# EAGLE design fri3d_badge_2016 (EAGLE 7.5.0)
CNAME: Fri3d Camp Badge; CREVISION: 5; DESIGNER: Christophe VG
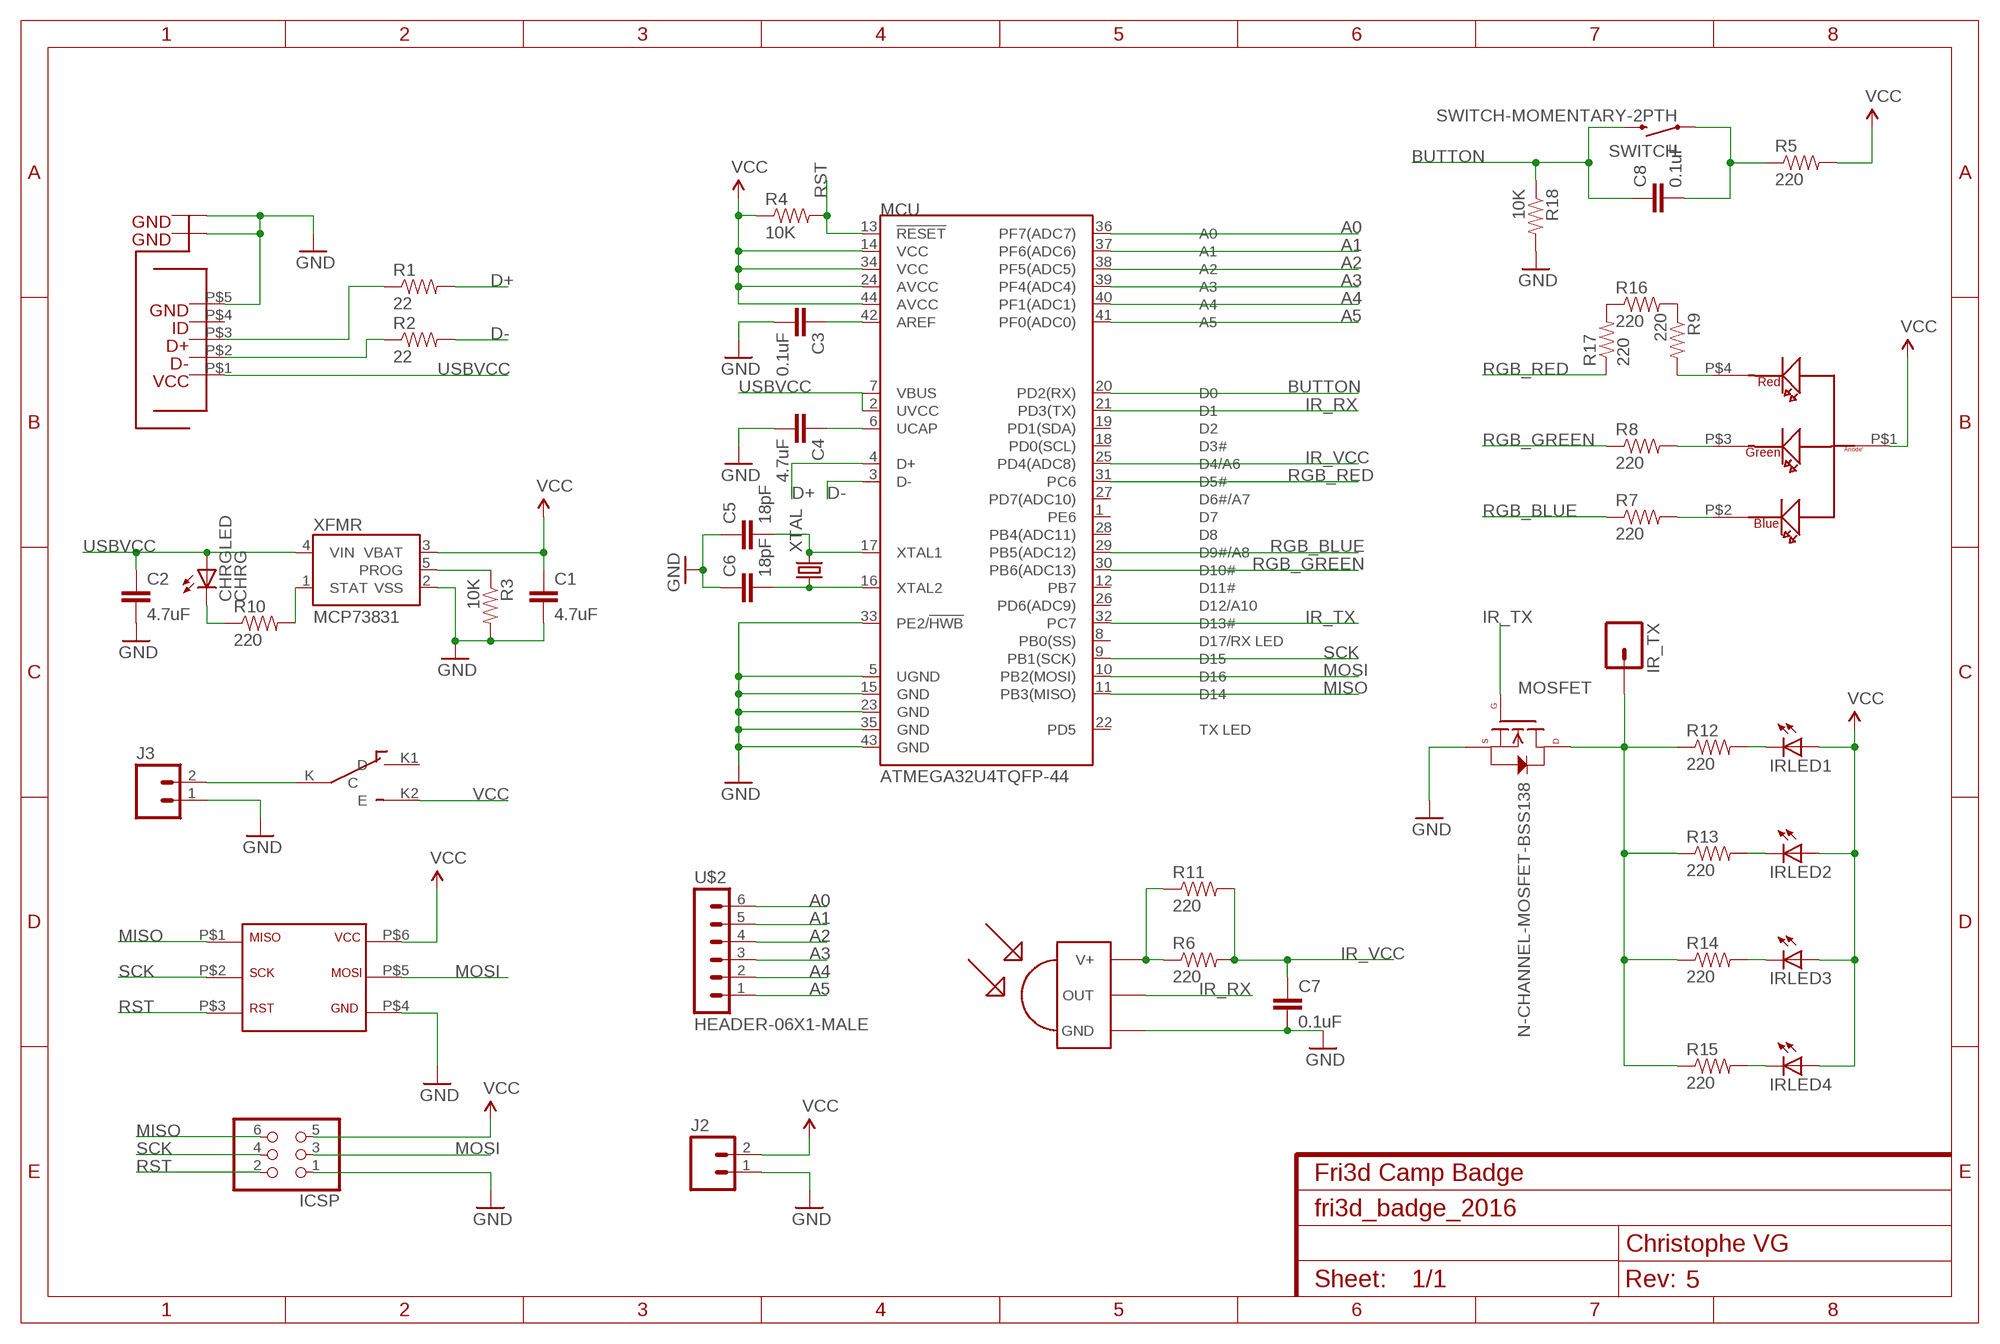
[diagram p0: schematic, sheet 1]

## Parts
C1  4.7uF  CAP0805  [0805]
C2  4.7uF  CAP0805  [0805]
C3  0.1uF  CAP0805  [0805]
C4  4.7uF  CAP0805  [0805]
C5  18pF  CAP0805  [0805]
C6  18pF  CAP0805  [0805]
C7  0.1uF  CAP0805  [0805]
C8  0.1uF  CAP0805  [0805]
CHRGLED  CHRG  LEDCHIPLED_0805  [CHIPLED_0805]
ICSP  PINHD-2X3  [2X03]
IR_TX  M01PTH  [1X01]
IRLED1  LEDCHIPLED_0805  [CHIPLED_0805]
IRLED2  LEDCHIPLED_0805  [CHIPLED_0805]
IRLED3  LEDCHIPLED_0805  [CHIPLED_0805]
IRLED4  LEDCHIPLED_0805  [CHIPLED_0805]
J2  M02PTH  [1X02]
J3  M02JST-PTH-2  [JST-2-PTH]
MCU  ATMEGA32U4TQFP-44  [TQFP44]
MOSFET  N-CHANNEL-MOSFET-BSS138  [SOT23-3]
R1  22  RESISTOR0805-RES  [0805]
R2  22  RESISTOR0805-RES  [0805]
R3  10K  RESISTOR0805-RES  [0805]
R4  10K  RESISTOR0805-RES  [0805]
R5  220  RESISTOR0805-RES  [0805]
R6  220  RESISTOR0805-RES  [0805]
R7  220  RESISTOR0805-RES  [0805]
R8  220  RESISTOR0805-RES  [0805]
R9  220  RESISTOR0805-RES  [0805]
R10  220  RESISTOR0805-RES  [0805]
R11  220  RESISTOR0805-RES  [0805]
R12  220  RESISTOR0805-RES  [0805]
R13  220  RESISTOR0805-RES  [0805]
R14  220  RESISTOR0805-RES  [0805]
R15  220  RESISTOR0805-RES  [0805]
R16  220  RESISTOR0805-RES  [0805]
R17  220  RESISTOR0805-RES  [0805]
R18  10K  RESISTOR0805-RES  [0805]
SWITCH  SWITCH-MOMENTARY-2PTH  [TACTILE-PTH]
U$2  HEADER-06X1-MALE  [06X1-PTH]
U$3  TSOP4838  [TSOP18XX]
U$4  DRAGAN-PERSONAL_AVAGO-RGB-LED  [DRAGAN-PERSONAL_AVAGO-RGB-LED]
U$5  OCTA-CORE_MCIRO-USB2MOUSER  [OCTA-CORE_MICRO-USB2]
U$6  SLIDE-SWITCH  [SLIDE-SWITCH]
U$7  OCTA-CORE_TC2030-IDC  [OCTA-CORE_TC2030-IDC]
XFMR  MCP73831  [SOT23-5]
XTAL  CRYSTALHC49S  [HC49/S]

## Nets
A0: MCU.36(PF7(ADC7)) U$2.6
A1: MCU.37(PF6(ADC6)) U$2.5
A2: MCU.38(PF5(ADC5)) U$2.4
A3: MCU.39(PF4(ADC4)) U$2.3
A4: MCU.40(PF1(ADC1)) U$2.2
A5: MCU.41(PF0(ADC0)) U$2.1
BUTTON: C8.1 MCU.20(PD2(RX)) R18.1 SWITCH.3
D+: MCU.4(D+) R1.2
D-: MCU.3(D-) R2.2
GND: C1.2 C2.2 C3.2 C4.2 C5.1 C6.1 C7.2 ICSP.1 J2.1 J3.1 MCU.5(UGND) MCU.15(GND) MCU.23(GND) MCU.33(PE2/!HWB) MCU.35(GND) MCU.43(GND) MOSFET.2(S) R3.2 R18.2 U$3.GND U$5.P$5 U$5.P$6 U$5.P$7 U$5.P$8 U$5.P$9 U$5.P$10 U$5.P$11 U$5.P$12 U$5.P$13 U$7.P$4 XFMR.2(VSS)
IR_RX: MCU.21(PD3(TX)) U$3.OUT
IR_TX: MCU.32(PC7) MOSFET.1(G)
IR_VCC: C7.1 MCU.25(PD4(ADC8)) R6.2 R11.2
MISO: ICSP.6 MCU.11(PB3(MISO)) U$7.P$1
MOSI: ICSP.3 MCU.10(PB2(MOSI)) U$7.P$5
N$1: R2.1 U$5.P$2
N$2: R1.1 U$5.P$3
N$3: C8.2 R5.1 SWITCH.1
N$4: C4.1 MCU.6(UCAP)
N$5: R3.1 XFMR.5(PROG)
N$6: CHRGLED.C R10.1
N$7: C3.1 MCU.42(AREF)
N$8: C5.2 MCU.17(XTAL1) XTAL.2
N$9: C6.2 MCU.16(XTAL2) XTAL.1
N$10: R6.1 R11.1 U$3.VCC(V+)
N$11: R9.1 R16.2
N$12: R16.1 R17.2
N$13: IRLED1.C R12.2
N$14: IRLED2.C R13.2
N$15: IRLED3.C R14.2
N$16: IRLED4.C R15.2
N$17: J3.2 U$6.K(C)
N$18: R9.2 U$4.P$4
N$19: R8.2 U$4.P$3
N$20: R7.2 U$4.P$2
N$22: R10.2 XFMR.1(STAT)
N$24: IR_TX.1 MOSFET.3(D) R12.1 R13.1 R14.1 R15.1
RGB_BLUE: MCU.29(PB5(ADC12)) R7.1
RGB_GREEN: MCU.30(PB6(ADC13)) R8.1
RGB_RED: MCU.31(PC6) R17.1
RST: ICSP.2 MCU.13(!RESET) R4.2 U$7.P$3
SCK: ICSP.4 MCU.9(PB1(SCK)) U$7.P$2
USBVCC: C2.1 CHRGLED.A MCU.2(UVCC) MCU.7(VBUS) U$5.P$1 XFMR.4(VIN)
VCC: C1.1 ICSP.5 IRLED1.A IRLED2.A IRLED3.A IRLED4.A J2.2 MCU.14(VCC) MCU.24(AVCC) MCU.34(VCC) MCU.44(AVCC) R4.1 R5.2 U$4.P$1 U$6.K2(E) U$7.P$6 XFMR.3(VBAT)
Unconnected: MCU.1(PE6) MCU.8(PB0(SS)) MCU.12(PB7) MCU.18(PD0(SCL)) MCU.19(PD1(SDA)) MCU.22(PD5) MCU.26(PD6(ADC9)) MCU.27(PD7(ADC10)) MCU.28(PB4(ADC11)) U$5.P$4 U$6.K1(D)

## Library data of the parts
C1-C8 = SparkFun-Capacitors:CAP: Capacitor Standard 0603 ceramic capacitor, and 0.1" leaded capacitor.
CHRGLED = adafruit:LED: LED
ICSP = SparkFun-Connectors:PINHD-2X3: PIN HEADER
IR_TX = SparkFun-Connectors:M01: Header 1 Standard 1-pin 0.1" header. Use with straight break away headers (SKU : PRT-00116), right angle break away headers (PRT-00553), swiss pins (PRT-00743), machine pins (PRT-00117), and female headers (PRT-00115). SMTSO-256-ET is a "flush mount" nut for a 4-40 screw. The older package used to be too tight, and did not allow it to sit properly thru the drill hit. The latest (0.165DIA) fits nice and snug.
IRLED1-IRLED4 = led:LED: LED
J2 = SparkFun-Connectors:M02: Standard 2-pin 0.1" header. Use with - straight break away headers ( PRT-00116) - right angle break away headers (PRT-00553) - swiss pins (PRT-00743) - machine pins (PRT-00117) - female headers (PRT-00115) Molex polarized connector foot print use with: PRT-08233 with associated crimp pins and housings. 2.54_SCREWTERM for use with PRT-10571. 3.5mm Screw Terminal footprints for PRT-08084 5mm Screw Terminal footprints for use with PRT-08432
J3 = SparkFun-Connectors:M02: Standard 2-pin 0.1" header. Use with - straight break away headers ( PRT-00116) - right angle break away headers (PRT-00553) - swiss pins (PRT-00743) - machine pins (PRT-00117) - female headers (PRT-00115) Molex polarized connector foot print use with: PRT-08233 with associated crimp pins and housings. 2.54_SCREWTERM for use with PRT-10571. 3.5mm Screw Terminal footprints for PRT-08084 5mm Screw Terminal footprints for use with PRT-08432; PROD_ID: CONN-09863; SKU: PRT-09914
MCU = SparkFun-DigitalIC:ATMEGA32U4: Atmel 44-pin 8-bit Microcontroller with 32KBytes of ISP Flash and USB Controller
MOSFET = GeekAmmo:N-CHANNEL-MOSFET: N-Channel MOSFET Mode Field Effect Transistor; DATASHEET: http://www.fairchildsemi.com/ds/BS/BSS138.pdf; DIGIKEY: BSS138TR-ND; ELEMENT14: 2323154; URL: http://au.element14.com/fairchild-semiconductor/bss138/mosfet-n-ch-50v-220ma-sot-23/dp/2323154
R1-R18 = SparkFun-Passives:RESISTOR: Resistor Basic schematic elements and footprints for 0603, 1206, and PTH resistors.
SWITCH = SparkFun-Electromechanical:SWITCH-MOMENTARY-2: Various NO switches- pushbuttons, reed, etc; PROD_ID: SWCH-08441
U$2 = GeekAmmo:HEADER-06X1?: 6 x 0.1 inch Header 40x1 0.1inch Male Breakaway header can be used. - 4UCON 00834 <http://www.4uconnector.com/online/SearchPro.asp?FormName=ProSearch&FormAction=search&s_GroupNo=&s_keyword=00834> For female part, if possible use 6 x 1 without breaking.; OTHER: 4UCON 00834; URL: http://www.4uconnector.com/online/SearchPro.asp?FormName=ProSearch&FormAction=search&s_GroupNo=&s_keyword=00834
U$3 = tsop:TSOP4838: IR Receiver and Demodulator
U$4 = Badge_EZR_V1:DRAGAN-PERSONAL_AVAGO-RGB-LED
U$5 = OCTA-EZR_v1:OCTA-CORE_MCIRO-USB2: Micr MICRO USB TYPE B RCPT W/ REAR PEGS. Mouser: 649-10118194-0001LF
U$6 = FriedCamp:SLIDE-SWITCH
U$7 = Badge_EZR_V1:OCTA-CORE_TC2030-IDC
XFMR = SparkFun-PowerIC:MCP73831: Miniature single cell, fully integrated Li-Ion, Li-polymer charge management controller http://ww1.microchip.com/downloads/en/DeviceDoc/20001984g.pdf IC-09995; PROD_ID: IC-09995
XTAL = crystal:CRYSTAL: CRYSTAL; OC_FARNELL: 1667008; OC_NEWARK: unknown

## Board
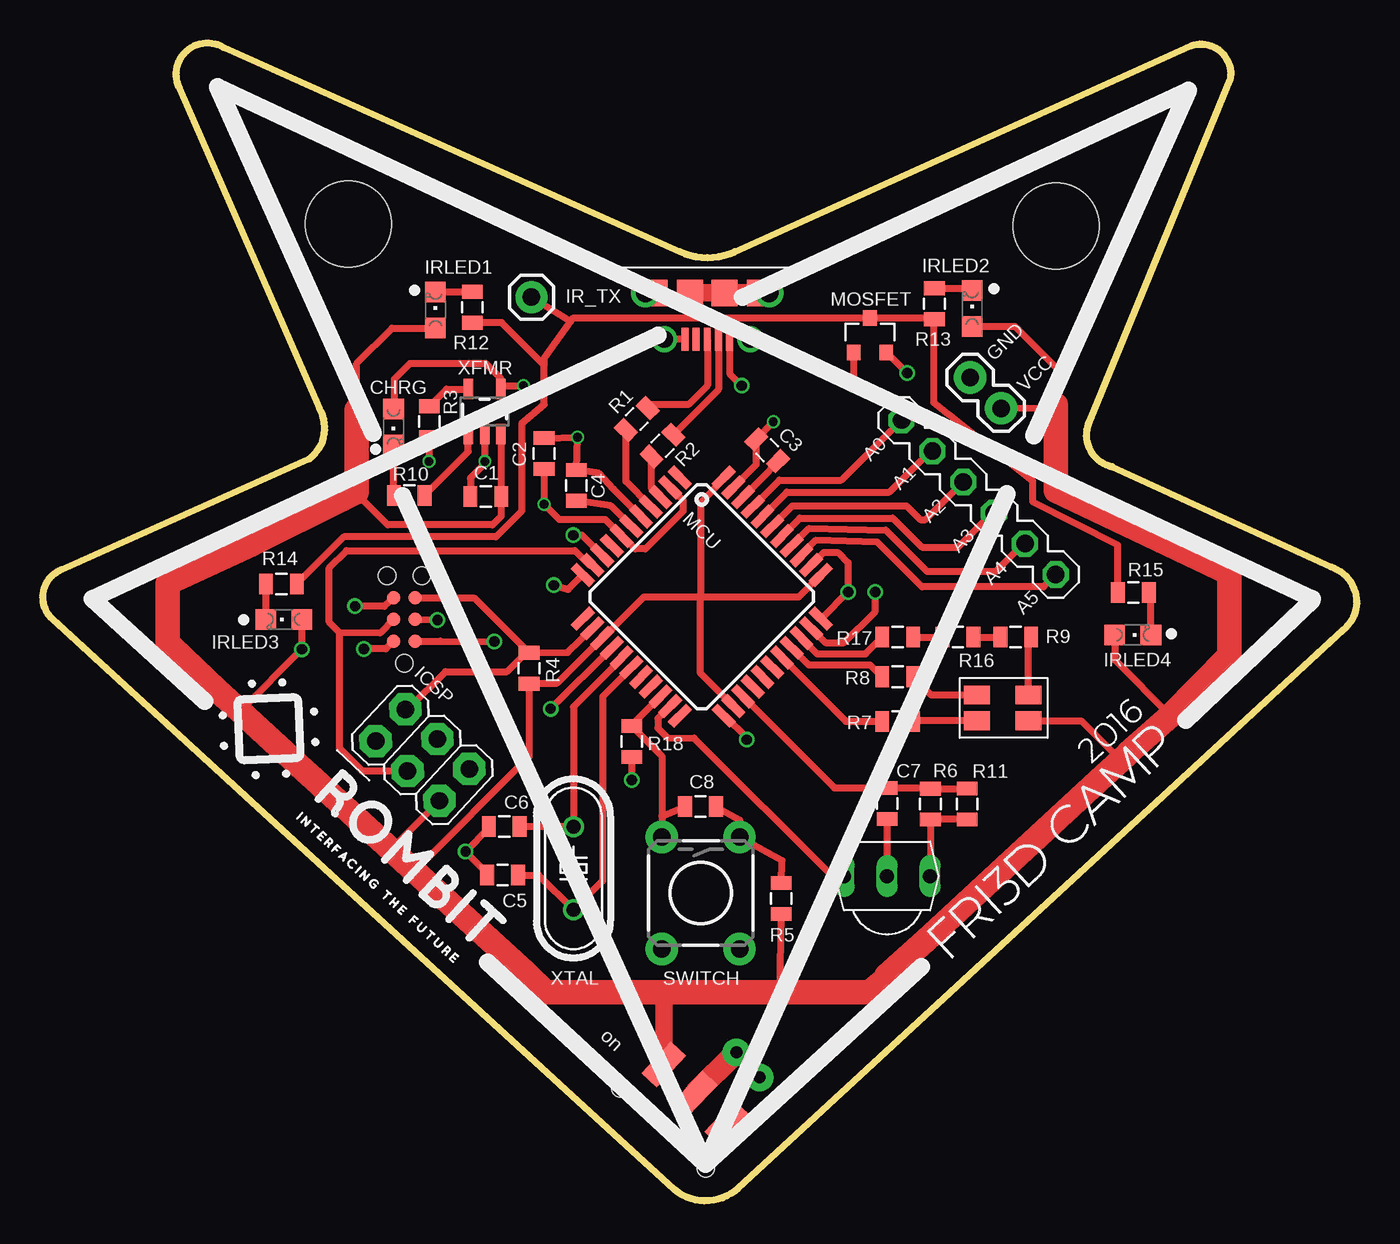
[diagram p1: board, top side]
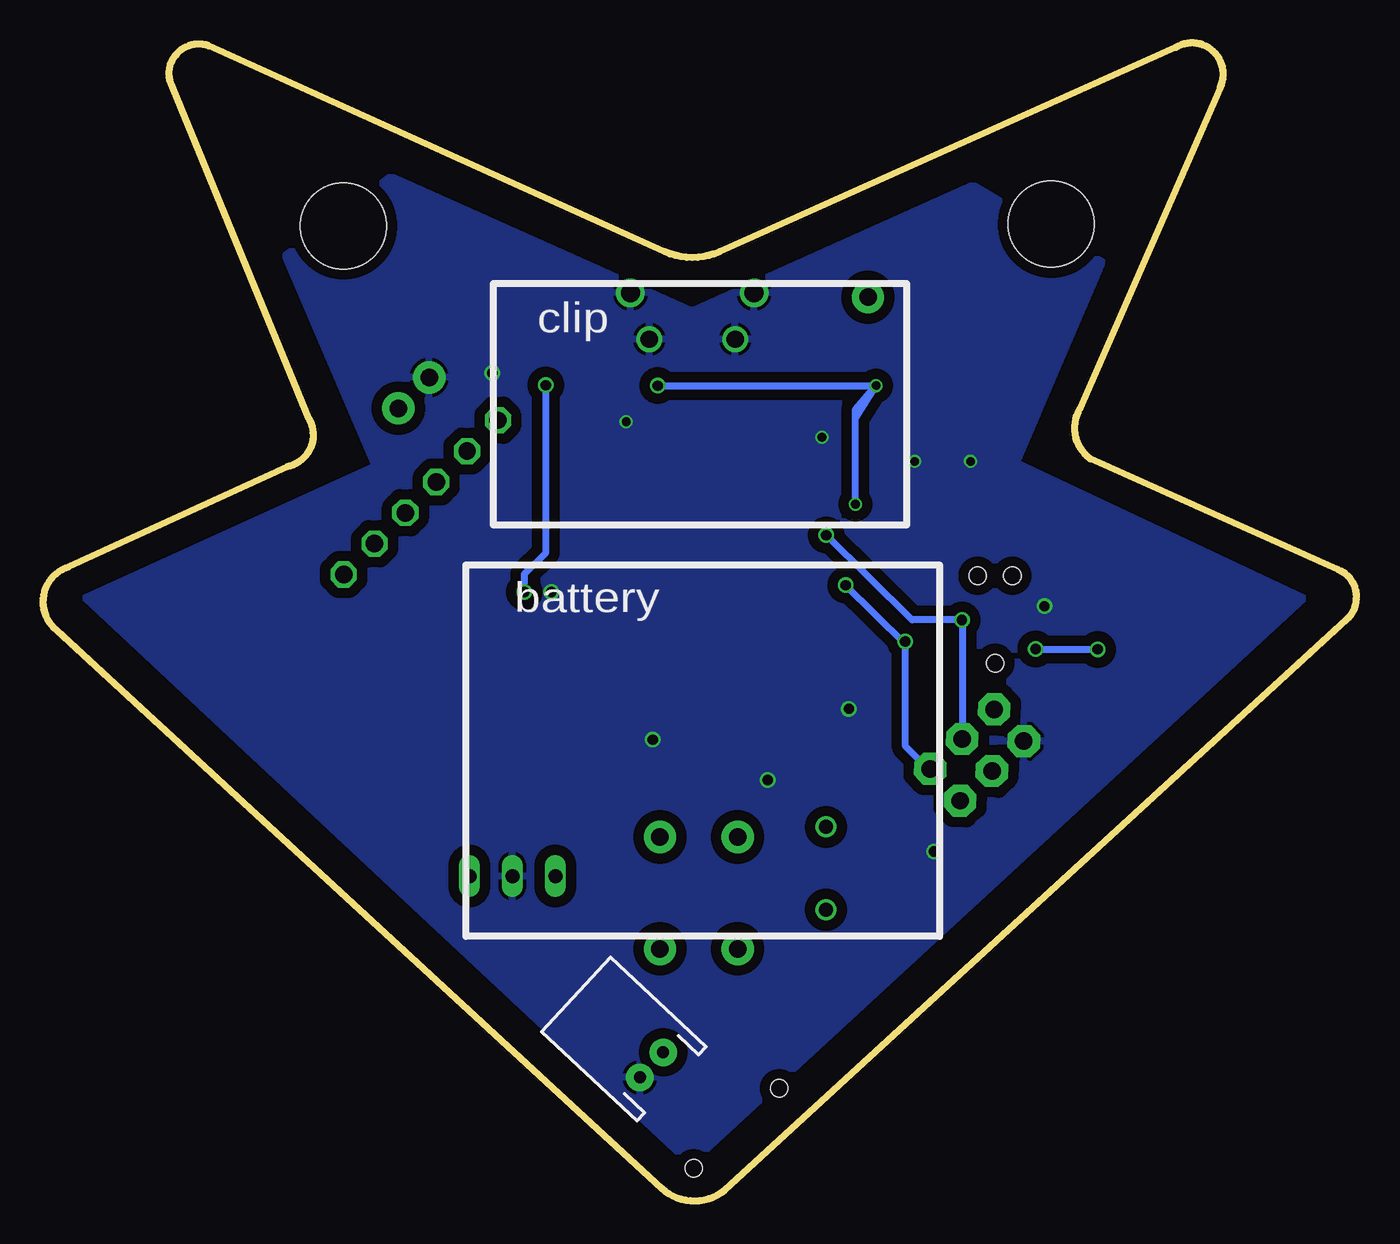
[diagram p2: board, bottom side, seen from below]

Size 76.47 x 67.38 mm. Coordinates in mm from the lower left corner, seen from the top.
Outline: 7.94,64.77 arc-146 10.51,67.12 37.07,55.23 arc49 40.27,55.23 66.83,67.21 arc-121 69.1,65.21 61.01,45.54 arc109 62.23,42.72 74.97,36.88 arc-124 75.67,33.2 40.47,0.73 arc-81 36.77,0.63 0.57,33.83 arc-115 1.07,36.73 15.5,43.17 arc83 16.1,46.1 7.94,64.77
Copper layers (1*16): Top 0.018mm / dielectric 1.55mm / Bottom 0.018mm
Design rules "eC_2Layer_PClass6_BaseCopperO18_eCDefault": minimum track width 0.15mm, minimum drill 0.35mm, track to track 0.15mm, track to pad 0.15mm, pad to pad 0.15mm, via to via 0.15mm, smd to smd 0mil, copper to edge 0.25mm, drill to drill 0.35mm, minimum pad ring 0.175mm, minimum via ring 0.125mm, stop-mask expansion 0mil, vias tented up to drill 0.45mm, thermal gap 0.2mm
Holes 5 mm at 17.77,56.83 58.97,56.73

### Footprints (pad centres in the part's own frame; a part is rotated, then mirrored left to right if it is on the bottom)
0805 = smd 0.8 x 1.2: 1 -0.9,0; 2 0.9,0
CHIPLED_0805 = smd 1.2 x 1.2: A 0,-1.05; C 0,1.05
2X03 = drill 1.016 pad 1.88 octagon: 1 -2.54,-1.27; 2 -2.54,1.27; 3 0,-1.27; 4 0,1.27; 5 2.54,-1.27; 6 2.54,1.27
1X01 = drill 1.016 pad 1.88: 1 0,0
1X02 = drill 1.016 pad 1.88: 1 0,0; 2 2.54,0
JST-2-PTH = drill 0.7 pad 1.6: 1 -1,0; 2 1,0
TQFP44 = smd 1.5 x 0.5: 1 -5.8,4; 2 -5.8,3.2; 3 -5.8,2.4; 4 -5.8,1.6; 5 -5.8,0.8; 6 -5.8,0; 7 -5.8,-0.8; 8 -5.8,-1.6; 9 -5.8,-2.4; 10 -5.8,-3.2; 11 -5.8,-4; 23 5.8,-4; 24 5.8,-3.2; 25 5.8,-2.4; 26 5.8,-1.6; 27 5.8,-0.8; 28 5.8,0; 29 5.8,0.8; 30 5.8,1.6; 31 5.8,2.4; 32 5.8,3.2; 33 5.8,4 | smd 0.5 x 1.5: 12 -4,-5.8; 13 -3.2,-5.8; 14 -2.4,-5.8; 15 -1.6,-5.8; 16 -0.8,-5.8; 17 0,-5.8; 18 0.8,-5.8; 19 1.6,-5.8; 20 2.4,-5.8; 21 3.2,-5.8; 22 4,-5.8; 34 4,5.8; 35 3.2,5.8; 36 2.4,5.8; 37 1.6,5.8; 38 0.8,5.8; 39 0,5.8; 40 -0.8,5.8; 41 -1.6,5.8; 42 -2.4,5.8; 43 -3.2,5.8; 44 -4,5.8
SOT23-3 = smd 0.8 x 0.9: 1 -0.95,-1; 2 0.95,-1; 3 0,1
TACTILE-PTH = drill 1.016 pad 1.88: 1 -3.251,2.261; 2 3.251,2.261; 3 -3.251,-2.261; 4 3.251,-2.261
06X1-PTH = drill 1.016 octagon: 1 -6.35,0; 2 -3.81,0; 3 -1.27,0; 4 1.27,0; 5 3.81,0; 6 6.35,0
TSOP18XX = drill 0.813 long: GND -0.001,-0.027; OUT -2.501,-0.027; VCC 2.499,-0.027
DRAGAN-PERSONAL_AVAGO-RGB-LED = smd 1.1 x 1.5: P$1 0,0; P$2 0,3; P$3 1.5,3; P$4 1.5,0
OCTA-CORE_MICRO-USB2 = smd 0.4 x 1.35: P$1 -1.3,0; P$2 -0.65,0; P$3 0,0; P$4 0.65,0; P$5 1.3,0 | drill 1 pad 1.5: P$6 -2.5,0; P$7 2.5,0 | smd 1.5 x 1.55: P$8 1,-2.7; P$9 -1,-2.7; P$10 -3.05,-2.7; P$11 3.05,-2.7 | drill 1.1 pad 1.6: P$12 -3.6,-2.7; P$13 3.6,-2.7
SLIDE-SWITCH = smd 1.2 x 2.5: K 0,0; K1 2.5,0; K2 -2.5,0 | hole 1: -3.4,-2.75; 3.4,-2.75
OCTA-CORE_TC2030-IDC = smd 0.8 x 0.8: P$1 1.27,-0.635; P$2 2.54,-0.635; P$3 3.81,-0.635; P$4 3.81,0.635; P$5 2.54,0.635; P$6 1.27,0.635 | hole 1: 0,0; 5.08,1.016; 5.08,-1.016
SOT23-5 = smd 0.55 x 1.2: 1 -0.95,-1.3; 2 0,-1.3; 3 0.95,-1.3; 4 0.95,1.3; 5 -0.95,1.3
HC49/S = drill 0.813: 1 -2.413,0; 2 2.413,0

### Placement (x,y rotation side)
C1  25.78,40.98 180 top
C2  29.17,43.48 90 top
C3  42.16,43.68 135 top
C4  31.05,41.63 90 top
C5  26.75,18.95 0 top
C6  26.85,21.78 0 top
C7  49.14,23.12 270 top
C8  38.28,22.94 0 top
CHRGLED  20.41,45.03 180 top
ICSP  22.09,25.94 317 top
IR_TX  28.44,52.58 0 top
IRLED1  22.85,51.84 0 top
IRLED2  54.09,51.93 0 top
IRLED3  14.02,33.83 90 top
IRLED4  63.44,32.93 270 top
J2  53.98,47.91 315 top
J3  41.04,7.91 47 bottom
MCU  38.35,35.15 315 top
MOSFET  48.14,50.37 0 top
R1  34.57,45.49 225 top
R2  36.06,43.94 225 top
R3  22.5,45.34 270 top
R4  28.3,30.99 90 top
R5  42.98,17.59 270 top
R6  51.66,23.08 90 top
R7  49.76,27.89 0 top
R8  49.75,30.49 0 top
R9  56.63,32.8 0 top
R10  21.32,41.05 0 top
R11  53.81,23.09 90 top
R12  25,52 90 top
R13  51.89,52.2 90 top
R14  13.88,35.9 180 top
R15  63.47,35.4 0 top
R16  53.26,32.8 0 top
R17  49.75,32.8 0 top
R18  34.27,26.73 270 top
SWITCH  38.29,17.91 270 top
U$2  54.47,40.93 315 top
U$3  49.14,18.92 0 top
U$4  57.37,27.93 90 top
U$5  38.67,50.13 180 top
U$6  37.97,6.23 317 top
U$7  21.04,31.29 90 top
XFMR  25.71,45.93 0 top
XTAL  30.88,19.34 270 top

### Tracks (layer width: path | path; a pad name or v marks a point on that pad's centre or on a via)
A0
  Top 0.406: U$2.6 58.25,35.73 51.17,35.73 48.57,38.33 44.97,38.43 44.19,37.66 MCU.36
A1
  Top 0.406: MCU.37 44.59,39.13 49.07,39.03 51.47,36.63 55.47,36.63 57.08,38.24 U$2.5
A2
  Top 0.406: MCU.38 44.06,39.73 49.47,39.73 51.17,38.03 53.27,38.03 55.27,40.04 U$2.4
A3
  Top 0.406: MCU.39 43.63,40.43 50.27,40.43 51.07,39.63 51.37,39.63 U$2.3
A4
  Top 0.406: 51.76,43.63 U$2.2 51.66,43.63 49.27,41.23 43.3,41.23 MCU.40
A5
  Top 0.406: MCU.41 42.87,41.93 46.47,41.93 49.96,45.42 U$2.1
BUTTON
  Top 0.406: C8.1 36.03,22.39 | 36.03,22.39 36.03,21.83 SWITCH.3 | MCU.20 34.27,27.68 R18.1 36.03,25.88 36.03,22.39
D+
  Top 0.406: 35.32,40.39 MCU.4 35.38,40.42 33.93,41.87 R1.2
D-
  Top 0.406: MCU.3 35.42,41.48 R2.2
GND  (via drill 0.5, 0.6)
  Top 0.406: MCU.5 33.22,41.42 32.37,42.33 C4.2 v31.12,44.43 C2.2 | R3.2 22.47,44.41 v22.47,43.03 | XFMR.2 v25.72,43.03 25.72,42.88 24.87,42.03 24.88,42.03 C1.2 | MCU.23 39.68,28.22 40.97,26.93 v40.97,26.83 | MCU.15 v29.55,28.63 | MCU.35 45.46,37.73 46.27,37.73 46.87,37.13 v46.87,35.43 45.32,33.88 MCU.33 | MCU.43 41.52,42.85 C3.2 42.54,45.33 v42.52,45.33 | R18.2 v34.27,24.49 | U$5.P$5 U$5.P$7 | U$7.P$4 19.87,34.59 v18.17,34.6 | C7.2 49.14,19.45 U$3.GND | C6.1 25.95,21.67 v24.6,20.32 25.85,19.07 C5.1 | MOSFET.2 v50.29,48.17 v50.3,48.17
  Top 1.016: U$5.P$8 U$5.P$9 U$5.P$10 U$5.P$12 | U$5.P$13 U$5.P$11
  pour Bottom (isolate 0.61): 3.05,35.06 19.81,42.96 14.79,54.64 22.33,59.11 38.69,51.8 56.21,59.61 62.38,54.98 57.13,42.77 74.04,35.09 38.77,2.13
IR_RX
  Top 0.406: MCU.21 35.79,28.07 35.79,27.51 36.36,26.94 37.9,26.92 45.95,18.88 U$3.OUT
IR_TX  (via drill 0.6)
  Top 0.406: MCU.32 45.55,32.48 46.64,32.48 48.45,34.29 v48.45,35.42 | MOSFET.1 v47.19,47.46
  Bottom 0.406: v47.19,47.46 47.19,37.72 48.45,36.46 v48.45,35.42
IR_VCC
  Top 0.406: MCU.25 46.07,24.02 C7.1 51.62,24.02 R6.2 R11.2
MISO  (via drill 0.6)
  Top 0.406: v29.74,35.82 30.57,35.58 MCU.11 | v26.27,32.54 23.12,32.56 U$7.P$1
  Bottom 0.406: v26.27,32.54 26.26,32.39 | 26.26,32.39 v29.74,35.82 | 26.26,32.39 26.26,26.44 24.96,25.14 ICSP.6
MOSI
  Top 0.406: 17.27,33.04 19.62,33.03 U$7.P$5 | 17.27,33.04 16.67,33.67 16.67,36.83 17.67,37.83 30.97,37.83 31.81,36.99 MCU.10 | 17.27,33.04 17.27,26.32 18.58,25.02 ICSP.3
N$1
  Top 0.406: U$5.P$2 39.32,47.2 R2.1
N$2
  Top 0.406: U$5.P$3 38.67,47.43 37.57,46.33 35.41,46.33 R1.1
N$3
  Top 0.406: R5.1 43.02,19.79 SWITCH.1 40.55,22.17 C8.2
N$4
  Top 0.406: MCU.6 33.06,40.45 C4.1
N$5
  Top 0.406: R3.1 23.49,47.23 XFMR.5
N$6
  Top 0.406: R10.1 CHRGLED.C
N$7
  Top 0.406: MCU.42 42.15,42.35 C3.1
N$8
  Top 0.406: MCU.17 34.25,31.01 32.58,29.34 32.58,18.61 30.9,16.93 XTAL.2 28.86,18.95 C5.2
N$9
  Top 0.406: 33.65,31.62 MCU.16 33.68,31.55 30.88,28.74 XTAL.1 30.85,21.78 C6.2
N$10
  Top 0.406: R11.1 R6.1 51.66,18.92 U$3.VCC
N$11
  Top 0.406: R16.2 R9.1
N$12
  Top 0.406: R17.2 R16.1
N$13
  Top 0.406: IRLED1.C 23.06,52.9 R12.2
N$14
  Top 0.406: R13.2 54.3,53.1 IRLED2.C
N$15
  Top 0.406: R14.2 IRLED3.C
N$16
  Top 0.406: IRLED4.C 64.49,35.28 R15.2
N$17
  Top 0.406: U$6.K 37.97,6.26
  Top 1.27: J3.2 37.97,6.26
N$18
  Top 0.406: U$4.P$4 57.37,32.64 R9.2
N$19
  Top 0.406: U$4.P$3 51.71,29.43 R8.2
N$20
  Top 0.406: U$4.P$2 50.7,27.93 R7.2
N$22
  Top 0.406: R10.2 24.76,43.59 XFMR.1
N$24
  Top 0.406: 29.17,48.63 29.17,46.33 27.87,45.23 27.87,40.13 26.37,38.63 17.51,38.63 R14.1 14.81,35.93 | 29.17,48.63 26.7,51.1 R12.1 | 30.73,51.18 30.87,51.37 MOSFET.3 | 30.73,51.18 29.17,49.03 29.17,48.63 | 51.84,51.36 R13.1 | R15.1 62.57,38.16 57.63,40.66 57.62,41.87 51.85,46.44 51.87,51.28 R13.1 | MOSFET.3 51.89,51.37 R13.1 | MOSFET.3 48.17,51.4 | IR_TX.1 30.73,51.18
RGB_BLUE
  Top 0.406: MCU.29 46.74,27.89 R7.1
RGB_GREEN
  Top 0.406: MCU.30 44.57,31.19 48.15,31.19 R8.1
RGB_RED
  Top 0.406: R17.1 47.88,31.83 45.06,31.83 MCU.31
RST
  Top 0.406: R4.2 30.54,31.91 MCU.13 | R4.2 25.09,35.08 U$7.P$3 | R4.2 28.11,31.89 27.01,30.79 23.43,30.79 21.24,28.61 ICSP.2
SCK  (via drill 0.6)
  Top 0.406: v30.87,38.73 31.38,38.73 MCU.9 | U$7.P$2 23.02,33.82 v22.97,33.8
  Bottom 0.406: v30.87,38.73 25.87,33.8 v22.97,33.8 22.96,33.79 ICSP.4 22.97,26.74
USBVCC  (via drill 0.5, 0.6)
  Top 0.406: CHRGLED.A 20.47,46.24 20.47,47.83 21.37,48.73 25.77,48.73 26.66,47.84 XFMR.4 26.86,47.43 v27.97,47.43 | C2.1 v29.17,40.53 30.07,39.63 32.74,39.63 MCU.7 33.71,38.69 34.47,37.93 35.07,37.93 37.27,40.13 37.27,40.76 MCU.2 | U$5.P$1 39.97,48.13 v40.67,47.43
  Bottom 0.406: v27.97,47.43 29.17,46.03 29.17,45.53 | v29.17,40.53 29.17,45.53 | 29.17,45.53 v27.97,47.43 | v40.67,47.43 v27.97,47.43
VCC  (via drill 0.6)
  Top 0.406: 17.43,40.77 17.43,40.81 | 10.11,29.77 10.11,29.74 | 18.27,46.03 18.27,48.73 20.32,50.78 22.74,50.78 IRLED1.A | 65.64,28.23 62.39,31.48 IRLED4.A 62.17,32.93 | 51.41,15.35 51.41,15.17 | 40.27,28.73 40.25,28.73 MCU.24 38.27,30.71 38.27,35.13 | MCU.34 43.99,35.13 38.27,35.13 | 17.37,40.23 18.27,41.13 | 18.27,41.13 18.27,41.53 | MCU.44 39.62,41.99 38.27,40.63 38.27,35.13 | 38.27,35.13 34.97,35.13 32.55,32.72 MCU.14 29.9,30.09 R4.1 28.3,25.86 21.63,19.19 | 53.29,17.22 53.29,16.9 | R5.2 42.87,12.13 | U$4.P$1 60.44,27.93 62.73,25.64 | 7.58,32.33 7.48,32.23 | 16.06,24.52 15.79,24.52 | 14.27,26.3 14.59,25.62 | 26.68,44.63 XFMR.3 26.66,41 C1.1 26.68,39.84 26.17,39.33 20.07,39.33 18.27,41.13 | 14.05,26.12 | J2.2 58.95,46.14 58.98,46.32 58.99,46.33 58.99,48.48 56.59,50.88 IRLED2.A | IRLED3.A v15.07,32.09 11.47,28.49 | U$7.P$6 19.96,32.11 v18.69,32.11 | ICSP.5 20.3,20.5 20.3,20.4
  Top 1.016: U$6.K2 36.14,12.06 36.07,12.13
  Top 1.27: 49.11,12.97 49.11,13.09
  Top 1.422: 18.27,46.03 18.27,41.53 18.27,41.23 17.43,40.81 12.19,38.19 7.27,35.93 7.27,32.43 7.48,32.23 10.11,29.74 11.47,28.49 12.61,27.44 14.05,26.12 14.59,25.62 15.79,24.52 19.24,21.37 20.3,20.4 21.63,19.19 28.08,13.3 29.27,12.13 36.07,12.13 42.87,12.13 48.07,12.13 49.11,12.97 | 63.37,26.23 63.2,26.07 | 63.2,26.07 63.11,26 62.73,25.64 61.43,24.44 53.29,16.9 51.41,15.17 49.11,13.09 | 63.2,26.07 65.64,28.23 69.07,31.73 69.07,36.53 58.97,41.33 58.98,46.32
  Bottom 0.406: v18.69,32.11 18.67,32.09 v15.07,32.09

### Text on the board
bPlace: clip | battery
tNames: GND | VCC | A0 | A1 | A2 | A3 | A4 | A5 | on